# Altium schematic sheet RF.SchDoc
size 420 x 297 mm; ENG_APP_DATE: --/--/--; DSN_APP_DATE: --/--/--; CHK_APP_DATE: --/--/--; Date: TEST; SheetNumber: 5; SheetTotal: 6; Sheet_Text_ProjectName: ApolloEcho_Dev_Kit; Sheet_Text_Author: mtnguyen; Sheet_Text_Title: RF; Sheet_Text_Rev: 2.0.0; Sheet_Text_Date: Mar 01, 25
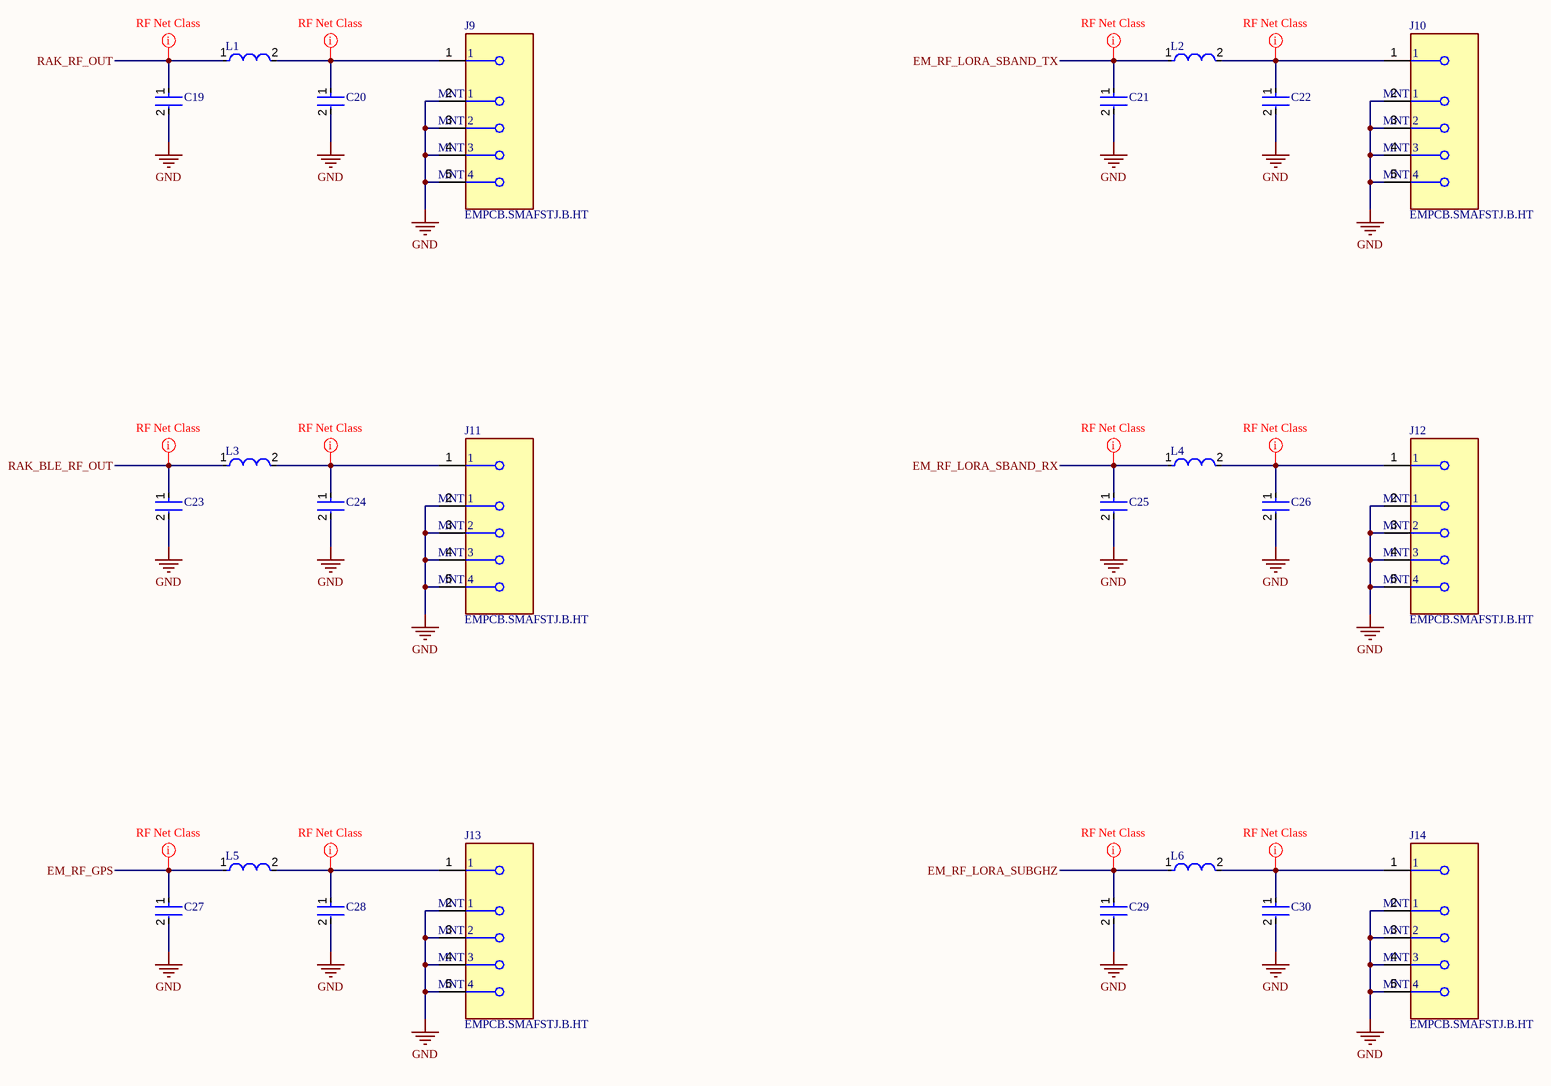
[diagram p0: RF.SchDoc]

## Parts
C19  GJM1555C1H5R0CB01D  [FP-GJM155-0_05-MFG]  (value not drawn)
C20  GJM1555C1H5R0CB01D  [FP-GJM155-0_05-MFG]  (value not drawn)
C21  GJM1555C1H5R0CB01D  [FP-GJM155-0_05-MFG]  (value not drawn)
C22  GJM1555C1H5R0CB01D  [FP-GJM155-0_05-MFG]  (value not drawn)
C23  GJM1555C1H5R0CB01D  [FP-GJM155-0_05-MFG]  (value not drawn)
C24  GJM1555C1H5R0CB01D  [FP-GJM155-0_05-MFG]  (value not drawn)
C25  GJM1555C1H5R0CB01D  [FP-GJM155-0_05-MFG]  (value not drawn)
C26  GJM1555C1H5R0CB01D  [FP-GJM155-0_05-MFG]  (value not drawn)
C27  GJM1555C1H5R0CB01D  [FP-GJM155-0_05-MFG]  (value not drawn)
C28  GJM1555C1H5R0CB01D  [FP-GJM155-0_05-MFG]  (value not drawn)
C29  GJM1555C1H5R0CB01D  [FP-GJM155-0_05-MFG]  (value not drawn)
C30  GJM1555C1H5R0CB01D  [FP-GJM155-0_05-MFG]  (value not drawn)
J9  EMPCB.SMAFSTJ.B.HT  [FP-EMPCB_SMAFSTJ_B_HT-MFG]
J10  EMPCB.SMAFSTJ.B.HT  [FP-EMPCB_SMAFSTJ_B_HT-MFG]
J11  EMPCB.SMAFSTJ.B.HT  [FP-EMPCB_SMAFSTJ_B_HT-MFG]
J12  EMPCB.SMAFSTJ.B.HT  [FP-EMPCB_SMAFSTJ_B_HT-MFG]
J13  EMPCB.SMAFSTJ.B.HT  [FP-EMPCB_SMAFSTJ_B_HT-MFG]
J14  EMPCB.SMAFSTJ.B.HT  [FP-EMPCB_SMAFSTJ_B_HT-MFG]
L1  LQW15AN2N9D00D  [FP-LQW15AN_00-W0_6-0_1-MFG]  (value not drawn)
L2  LQW15AN2N9D00D  [FP-LQW15AN_00-W0_6-0_1-MFG]  (value not drawn)
L3  LQW15AN2N9D00D  [FP-LQW15AN_00-W0_6-0_1-MFG]  (value not drawn)
L4  LQW15AN2N9D00D  [FP-LQW15AN_00-W0_6-0_1-MFG]  (value not drawn)
L5  LQW15AN2N9D00D  [FP-LQW15AN_00-W0_6-0_1-MFG]  (value not drawn)
L6  LQW15AN2N9D00D  [FP-LQW15AN_00-W0_6-0_1-MFG]  (value not drawn)

## Nets
GND: C19.2 C20.2 C21.2 C22.2 C23.2 C24.2 C25.2 C26.2 C27.2 C28.2 C29.2 C30.2 J9.2(MNT_1) J9.3(MNT_2) J9.4(MNT_3) J9.5(MNT_4) J10.2(MNT_1) J10.3(MNT_2) J10.4(MNT_3) J10.5(MNT_4) J11.2(MNT_1) J11.3(MNT_2) J11.4(MNT_3) J11.5(MNT_4) J12.2(MNT_1) J12.3(MNT_2) J12.4(MNT_3) J12.5(MNT_4) J13.2(MNT_1) J13.3(MNT_2) J13.4(MNT_3) J13.5(MNT_4) J14.2(MNT_1) J14.3(MNT_2) J14.4(MNT_3) J14.5(MNT_4)
EM_RF_GPS: C27.1 L5.1
EM_RF_LORA_SBAND_RX: C25.1 L4.1
EM_RF_LORA_SBAND_TX: C21.1 L2.1
EM_RF_LORA_SUBGHZ: C29.1 L6.1
RAK_BLE_RF_OUT: C23.1 L3.1
RAK_RF_OUT: C19.1 L1.1
NetC20_1: C20.1 J9.1 L1.2
NetC22_1: C22.1 J10.1 L2.2
NetC24_1: C24.1 J11.1 L3.2
NetC26_1: C26.1 J12.1 L4.2
NetC28_1: C28.1 J13.1 L5.2
NetC30_1: C30.1 J14.1 L6.2

## Layout directives
net class RF_Nets: EM_RF_GPS, EM_RF_LORA_SBAND_RX, EM_RF_LORA_SBAND_TX, EM_RF_LORA_SUBGHZ, NetC20_1, NetC22_1, NetC24_1, NetC26_1, NetC28_1, NetC30_1, RAK_BLE_RF_OUT, RAK_RF_OUT

## Notes on the sheet
- THIS DOCUMENT AND THE DATA DISCLOSED HEREIN OR
- HEREWITH IS THE PROPERTY OF ALTIUM LIMITED AND MAY
- BE FREELY DISTRIBUTED IN WHOLE. NO RIGHTS ARE
- RESERVED OR EXPRESS OR IMPLIED WARANTEE GIVEN.
- PROJECT NAME
- TITLE
- AUTHOR
- Rev.
- FILE NAME
- Date
- SHEET
- OF

## Library data of the parts
C19-C30 = CMP-2008-03860-2: Multi-Layer Ceramic Capacitor 5pF C0G  ±0.25pF 0402 Paper T/R; Voltage Rating: 50V; Length: 1mm; Case Code (Metric): 1005; Thickness: 0.022inch; Height: 0.5mm; Capacitance: 5pF; Mount: Surface Mount; Case Code (Imperial): 0402; Package Quantity: 1; Termination: SMD/SMT; Radiation Hardening: No; Lead Free: Lead Free; Max Operating Temperature: 125°C; Dielectric: C0G; Case/Package: 0402; Depth: 0.5mm; Width: 0.02inch; Packaging: Tape and Reel; Min Operating Temperature: -55°C; Voltage Rating (DC): 50V
J9-J14 = CMP-111093-000001-1: CONN SMA JACK STR 50OHM EDGE MNT; Manufacturer: Taoglas Limited; Conn Orientation: Horizontal; Frequency: 12.4GHz; Impedance: 50Ω; Voltage Rating: 335V; Is Female: yes; Pitch: 2.62mm; Number Of Contacts: 1; Device Class L2: RF / Coaxial Connectors; Category: Conn; Contact Material: Gold; Device Class L1: Connectors; Digikey Description: CONN SMA JACK STR 50OHM EDGE MNT; Temperature Range Low: -40°C; Octopart: https://octopart.com/empcb.smafstj.b.ht-taoglas-24204431; ComponentLink2URL: https://cdn.taoglas.com/datasheets/EMPCB.SMAFSTJ.B.HT.pdf; Temperature Range High: +85°C; Device Class L3: unset; Temperature: -40°C to +85°C; Package: 0; RoHS: TRUE; Lead Free: Yes; Automotive: No; ComponentLink2Description: Datasheet; Mouser Description: RF Connectors / Coaxial Connectors SMA Straight Edge Mount PCB Jack-Gold; Manufacturer Part Number: EMPCB.SMAFSTJ.B.HT
L1-L6 = CMP-06042-011289-1: Wire Wound RF Inductor 2.9nH ±0.5nH 750mA 0.07Ω 0402 (1005); DC Resistance (DCR): 70mR; Core Material: Non-Magnetic; Shielding: Unshielded; Self Resonant Frequency: 15GHz; Test Frequency: 100MHz; Q Factor: 20; Radiation Hardening: No; DC Current: 750mA; Resistor Type: Wirewound; Case Code (Metric): 1005; Max Operating Temperature: 125°C; Height - Seated (Max): 0.024inch; Case Code (Imperial): 0402; Max DC Current: 750mA; Packaging: Tape and Reel; Width: 0.02inch; Height: 0.5mm; Mount: Surface Mount; Depth: 0.7mm; Weight: 2.8E-05oz; Inductance: 2.9nH; Termination: SMD/SMT; Length: 1mm; Min Operating Temperature: -55°C; Current Rating: 750mA; Military Standard: Not; Package Quantity: 1; Case/Package: 0402